# Altium project Universal_PLC.PrjPcb (part 1 of 2)
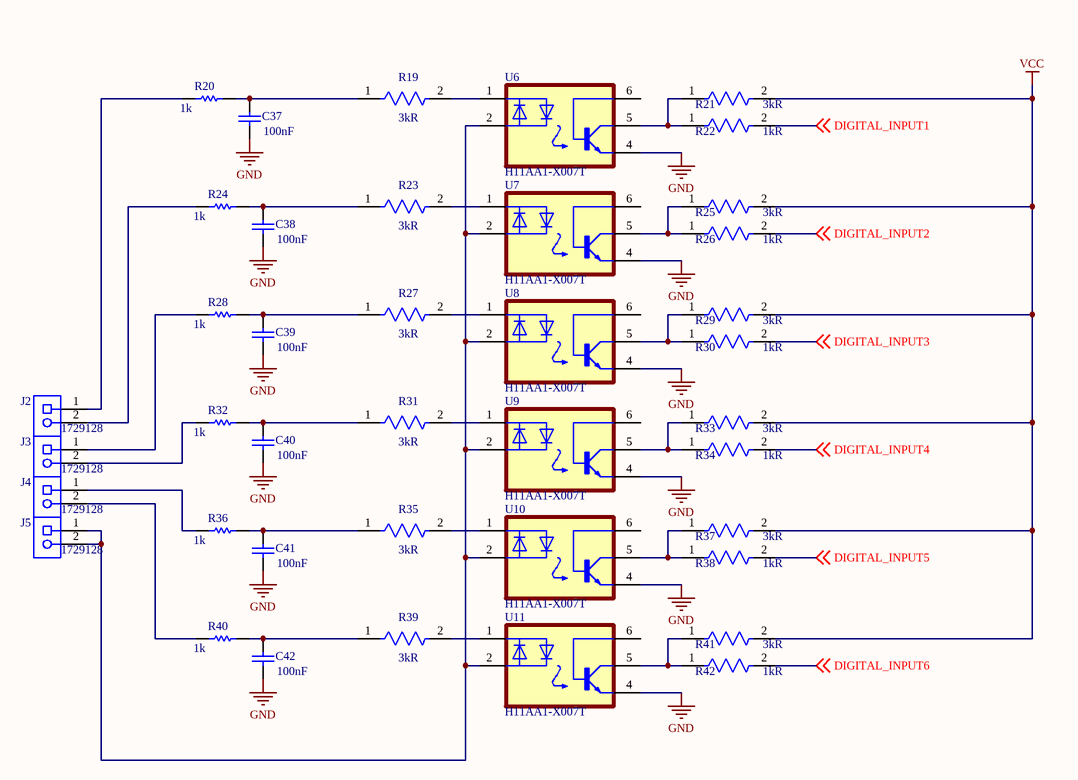
[diagram p0: Digital_Input.SchDoc]
8 sheets, 283 parts. Net scope: global (net labels, ports and power ports of the same name join across sheets).
Board file: Universal_PCB.PcbDoc
Sheets:
  Digital_Input.SchDoc
  Digital_Input2.SchDoc
  Digital_Input3.SchDoc
  DIGITAL_OUTPUT.SchDoc
  DIGITAL_OUTPUT1.SchDoc
  ANALOG_IOUTPUT.SchDoc
  ANALOG_VOUTPUT.SchDoc
  Temp_sensors Input.SchDoc

## Sheet Digital_Input.SchDoc
size A4; SheetNumber: 2; SheetTotal: 16

### Parts
C37  value 100nF  [CAPC1608X87X35NL15T15]  (hidden comment: C0603T104K3RACTU)
C38  value 100nF  [CAPC1608X87X35NL15T15]  (hidden comment: C0603T104K3RACTU)
C39  value 100nF  [CAPC1608X87X35NL15T15]  (hidden comment: C0603T104K3RACTU)
C40  value 100nF  [CAPC1608X87X35NL15T15]  (hidden comment: C0603T104K3RACTU)
C41  value 100nF  [CAPC1608X87X35NL15T15]  (hidden comment: C0603T104K3RACTU)
C42  value 100nF  [CAPC1608X87X35NL15T15]  (hidden comment: C0603T104K3RACTU)
J2  1729128  [PHOE-1729128-2_V]
J3  1729128  [PHOE-1729128-2_V]
J4  1729128  [PHOE-1729128-2_V]
J5  1729128  [PHOE-1729128-2_V]
R19  Resistance: 3kR  [FP-CRCW0603-e3-IPC_A]  (hidden comment: CRCW06033K00FKEA)
R20  value 1k  [RESC1608X55X25LL10T15]  (hidden comment: RT0603DRE071KL)
R21  Resistance: 3kR  [FP-CRCW0603-e3-IPC_A]  (hidden comment: CRCW06033K00FKEA)
R22  Resistance: 1kR  [FP-RC0603-0_55-IPC_C]  (hidden comment: RC0603FR-071KL)
R23  Resistance: 3kR  [FP-CRCW0603-e3-IPC_A]  (hidden comment: CRCW06033K00FKEA)
R24  value 1k  [RESC1608X55X25LL10T15]  (hidden comment: RT0603DRE071KL)
R25  Resistance: 3kR  [FP-CRCW0603-e3-IPC_A]  (hidden comment: CRCW06033K00FKEA)
R26  Resistance: 1kR  [FP-RC0603-0_55-IPC_C]  (hidden comment: RC0603FR-071KL)
R27  Resistance: 3kR  [FP-CRCW0603-e3-IPC_A]  (hidden comment: CRCW06033K00FKEA)
R28  value 1k  [RESC1608X55X25LL10T15]  (hidden comment: RT0603DRE071KL)
R29  Resistance: 3kR  [FP-CRCW0603-e3-IPC_A]  (hidden comment: CRCW06033K00FKEA)
R30  Resistance: 1kR  [FP-RC0603-0_55-IPC_C]  (hidden comment: RC0603FR-071KL)
R31  Resistance: 3kR  [FP-CRCW0603-e3-IPC_A]  (hidden comment: CRCW06033K00FKEA)
R32  value 1k  [RESC1608X55X25LL10T15]  (hidden comment: RT0603DRE071KL)
R33  Resistance: 3kR  [FP-CRCW0603-e3-IPC_A]  (hidden comment: CRCW06033K00FKEA)
R34  Resistance: 1kR  [FP-RC0603-0_55-IPC_C]  (hidden comment: RC0603FR-071KL)
R35  Resistance: 3kR  [FP-CRCW0603-e3-IPC_A]  (hidden comment: CRCW06033K00FKEA)
R36  value 1k  [RESC1608X55X25LL10T15]  (hidden comment: RT0603DRE071KL)
R37  Resistance: 3kR  [FP-CRCW0603-e3-IPC_A]  (hidden comment: CRCW06033K00FKEA)
R38  Resistance: 1kR  [FP-RC0603-0_55-IPC_C]  (hidden comment: RC0603FR-071KL)
R39  Resistance: 3kR  [FP-CRCW0603-e3-IPC_A]  (hidden comment: CRCW06033K00FKEA)
R40  value 1k  [RESC1608X55X25LL10T15]  (hidden comment: RT0603DRE071KL)
R41  Resistance: 3kR  [FP-CRCW0603-e3-IPC_A]  (hidden comment: CRCW06033K00FKEA)
R42  Resistance: 1kR  [FP-RC0603-0_55-IPC_C]  (hidden comment: RC0603FR-071KL)
U6  H11AA1-X007T  [SOIC254P1030X460-6N]
U7  H11AA1-X007T  [SOIC254P1030X460-6N]
U8  H11AA1-X007T  [SOIC254P1030X460-6N]
U9  H11AA1-X007T  [SOIC254P1030X460-6N]
U10  H11AA1-X007T  [SOIC254P1030X460-6N]
U11  H11AA1-X007T  [SOIC254P1030X460-6N]

### Nets
GND: C37.1 C38.1 C39.1 C40.1 C41.1 C42.1 U6.4(E) U7.4(E) U8.4(E) U9.4(E) U10.4(E) U11.4(E)
VCC: R21.2 R25.2 R29.2 R33.2 R37.2 R41.2
DIGITAL_INPUT1: R22.2 ; off-sheet DIGITAL_INPUT1
DIGITAL_INPUT2: R26.2 ; off-sheet DIGITAL_INPUT2
DIGITAL_INPUT3: R30.2 ; off-sheet DIGITAL_INPUT3
DIGITAL_INPUT4: R34.2 ; off-sheet DIGITAL_INPUT4
DIGITAL_INPUT5: R38.2 ; off-sheet DIGITAL_INPUT5
DIGITAL_INPUT6: R42.2 ; off-sheet DIGITAL_INPUT6
NetC37_2: C37.2 R19.1 R20.2
NetC38_2: C38.2 R23.1 R24.2
NetC39_2: C39.2 R27.1 R28.2
NetC40_2: C40.2 R31.1 R32.2
NetC41_2: C41.2 R35.1 R36.2
NetC42_2: C42.2 R39.1 R40.2
NetJ2_1: J2.1 R20.1
NetJ2_2: J2.2 R24.1
NetJ3_1: J3.1 R28.1
NetJ3_2: J3.2 R32.1
NetJ4_1: J4.1 R36.1
NetJ4_2: J4.2 R40.1
NetJ5_1: J5.1 J5.2 U6.2(C/A) U7.2(C/A) U8.2(C/A) U9.2(C/A) U10.2(C/A) U11.2(C/A)
NetR19_2: R19.2 U6.1(A/C)
NetR21_1: R21.1 R22.1 U6.5(C)
NetR23_2: R23.2 U7.1(A/C)
NetR25_1: R25.1 R26.1 U7.5(C)
NetR27_2: R27.2 U8.1(A/C)
NetR29_1: R29.1 R30.1 U8.5(C)
NetR31_2: R31.2 U9.1(A/C)
NetR33_1: R33.1 R34.1 U9.5(C)
NetR35_2: R35.2 U10.1(A/C)
NetR37_1: R37.1 R38.1 U10.5(C)
NetR39_2: R39.2 U11.1(A/C)
NetR41_1: R41.1 R42.1 U11.5(C)

Not connected (* = marked no-connect by the designer): U6 6(B); U7 6(B); U8 6(B); U9 6(B); U10 6(B); U11 6(B)

### Library data of the parts
C37-C42 = CMP-2006-03843-1: Manufacturer: Kemet; Part Number: C0603T104K3RACTU
J2-J5 = CMP-2000-05815-1: PCB Terminal Block, 13.5 A, 400 V, 2-Pin THD, RoHS, Bulk; Manufacturer: Phoenix Contact; Package Version: 03/2015; No. of Rows: 1; Pitch: 5.08mm; No. of Positions: 2; Voltage Rating: 400V; Current Rating: 13500mA; Manufacturer URL: http://www.phoenixcontact.com/; Datasheet URL: https://datasheet.ciiva.com/16046/1729128-16046181.pdf; RoHS: TRUE; Package URL: https://www.phoenixcontact.com/online/portal/pi/pxc/product_detail_page/!ut/p/b1/3VdJjqNKFDxLH8AFycySyWY2ozFsEPOMMQaDOX1XedGL_1Vdm5YXJleknhSKeBkvI6EA8ncAo3AYoDhBQGco6KN7VURTdemj9us_IEKEZo_YHiPAEWEFmDGOHMORkqKYCORBZxgL7ZoaZYcbFFUZ3fqxSY6GOuxydWUuHqz1ynmMFygu583Bob0Ewr6Sd_l-5m-kAueHiB0jpRwZwe58wwtkpxtMYd_LmGcDRU02dRNEyWt6Y2ti5pSyJ_reIkzIulrqApdnbT11V5jnCKbYNCvhEM1MCpPByat_X379-iThf08CI5GfOPqfBeS3BRoBOdD55AKVv0iLwCMq-2BrzXWSGRH7pUGD9uwXQjiph3xL0DKQwdGa0JImiIOmBNOestqgwTHSSs2oOep-78apyXQBvNi8ZLaFjvjWvcaUEBu0MC6Wbe-d6mB0FAebo2lUWinqYaZs5DAYzV0RP9yitUjnGJ0iI9xhZkT42OCQNUJJhkgWINNQLP2JFP6OpMg3JCVg70jqHT0lvKOnhHf0lPuOnnLf0VPuWx6_dxwUIvwk5WMkT0kLL1mh61l2yZVSzG3pYV_bqo-mj6uMKwKwdnnW8Jh5RTOJzMOA5c-eJDaZQw4mTMPH02PvS_ZAqNVjVTo2WyYLkwH_KU1mmmG5kjRhDqPXLwwVHvVOjCM60-fpXvTDfMGW1PVFVS1r4e4yVDk4ZdNbkUHvqPqQSeian4UD39fNKmachqdJ1NJbyk8rXT9mXTvPk3oE5meulKGgiruPJek-4I9hTT6G8ZLOyRSm2RRVbThERQad5OS28hdt4YW4vG0stgYYzsWsK4_7y6DZMjJSCqri1kyiZR5vD7pwIrNR7QwPHTcLTI5qT7eRlpHrdGiupYlqQDJ7zy_CND8fWWBoLRXxk1RVcXiBQwbTD4Xi7KL-FuO94t9xaqweXzH; PartNumber: 1729128; Package Description: 2-Pin Through Hole Device, Body 8.1 x 10.16 mm, Pitch 5.08 mm; Datasheet Version: 12/2013; Mounting Technology: ThroughHole; Orientation: Horizontal; Package Reference: 1729128-2; Packing: Bulk
R19 R21 R23 R25 R27 R29 R31 R33 R35 R37 R39 R41 = CMP-2000-03293-2: RES Thick Film, 3kΩ, 1%, 0.1W, 100ppm/°C, 0603; Voltage Rating: 75V; Power Rating: 100mW; Features: Automotive AEC-Q200; Radiation Hardening: No; Contact Plating: Tin; Termination: SMD/SMT; Lead Free: Lead Free; Case Code (Imperial): 0603; Case Code (Metric): 1608; Case/Package: 0603; Depth: 0.85mm; Mount: Surface Mount; Voltage Rating (DC): 75V; Tolerance: 1%; Package Quantity: 10; Temperature Coefficient: 100ppm/°C; Height: 0.45mm; Max Power Dissipation: 100mW; Composition: Thick Film; Max Operating Temperature: 155°C; Military Standard: Not; Weight: 7.1E-05oz; Length: 1.55mm; Packaging: Tape and Reel; Number of Terminations: 2; Width: 0.85mm; Min Operating Temperature: -55°C
R20 R24 R28 R32 R36 R40 = CMP-2000-04615-1: Manufacturer: Yageo; Part Number: RT0603DRE071KL
R22 R26 R30 R34 R38 R42 = CMP-1659-00009-5: RES 1K OHM 1% 1/10W 0603; Voltage Rating: 50V; Power Rating: 100mW; Temperature Coefficient: 100ppm/°C; Military Standard: Not; REACH SVHC: No SVHC; Size Code: 0603; Features: Moisture Resistant; Number of Terminations: 2; Technology: THICK FILM; Series: RC; Case Code (Metric): 1608; Resistance Tolerance: 1%; Resistor Type: Thick Film; Termination: SMD/SMT; Contact Plating: Tin; Radiation Hardening: No; Min Operating Temperature: -55°C; Max Operating Temperature: 155°C; Packaging: Tape and Reel; Max Power Dissipation: 100mW; RoHS Compliant: Yes; Height: 0.45mm; Lead Free: Lead Free; Case/Package: 0603; Length: 1.6mm; Tolerance: 1%; Case Code (Imperial): 0603; Construction: Rectangular; Depth: 0.8mm
U6-U11 = H11AA1-X007T: H11AA1 Series Single Channel 30V 5300 Vrms SMT Phototransistor Optocoupler DIP-6; MF: Vishay Semiconductor; SnapEDA_Link: https://www.snapeda.com/parts/H11AA1-X007T/Vishay/view-part/?ref=snap; Package: SMD-6 Vishay; Value: *; MP: H11AA1-X007T; Check_prices: https://www.snapeda.com/parts/H11AA1-X007T/Vishay/view-part/?ref=eda

## Sheet Digital_Input2.SchDoc
size A4; SheetNumber: 3; SheetTotal: 16
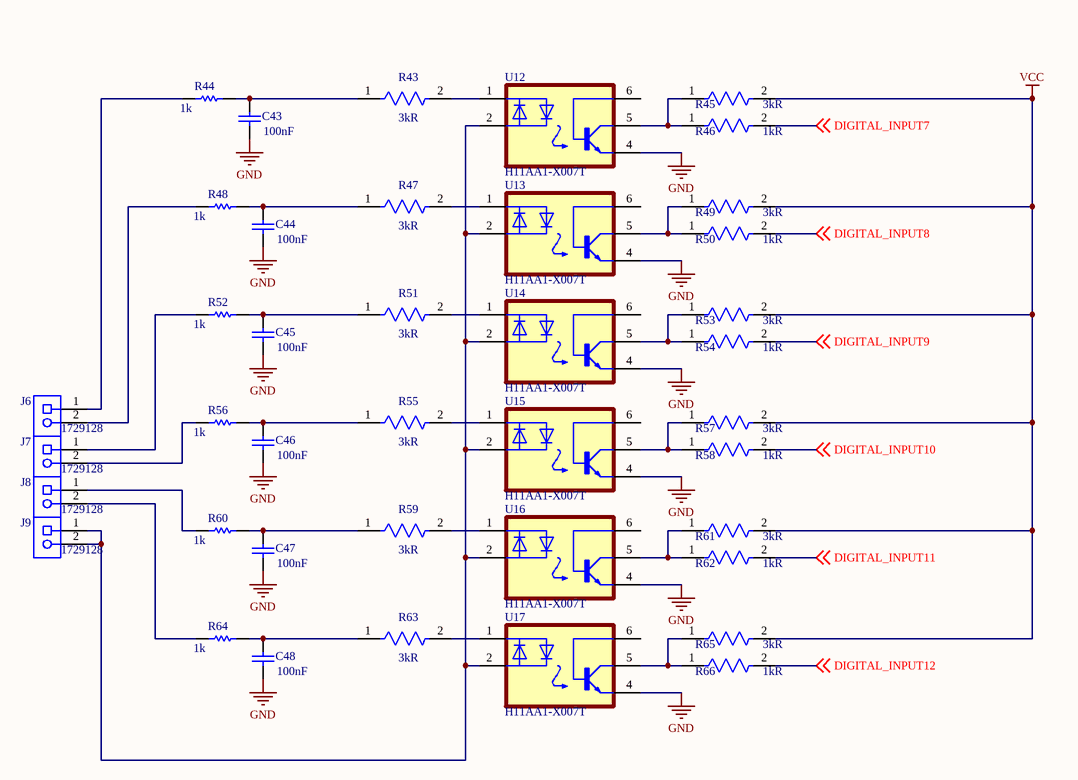
[diagram p1: Digital_Input2.SchDoc]

### Parts
C43  value 100nF  [CAPC1608X87X35NL15T15]  (hidden comment: C0603T104K3RACTU)
C44  value 100nF  [CAPC1608X87X35NL15T15]  (hidden comment: C0603T104K3RACTU)
C45  value 100nF  [CAPC1608X87X35NL15T15]  (hidden comment: C0603T104K3RACTU)
C46  value 100nF  [CAPC1608X87X35NL15T15]  (hidden comment: C0603T104K3RACTU)
C47  value 100nF  [CAPC1608X87X35NL15T15]  (hidden comment: C0603T104K3RACTU)
C48  value 100nF  [CAPC1608X87X35NL15T15]  (hidden comment: C0603T104K3RACTU)
J6  1729128  [PHOE-1729128-2_V]
J7  1729128  [PHOE-1729128-2_V]
J8  1729128  [PHOE-1729128-2_V]
J9  1729128  [PHOE-1729128-2_V]
R43  Resistance: 3kR  [FP-CRCW0603-e3-IPC_A]  (hidden comment: CRCW06033K00FKEA)
R44  value 1k  [RESC1608X55X25LL10T15]  (hidden comment: RT0603DRE071KL)
R45  Resistance: 3kR  [FP-CRCW0603-e3-IPC_A]  (hidden comment: CRCW06033K00FKEA)
R46  Resistance: 1kR  [FP-RC0603-0_55-IPC_C]  (hidden comment: RC0603FR-071KL)
R47  Resistance: 3kR  [FP-CRCW0603-e3-IPC_A]  (hidden comment: CRCW06033K00FKEA)
R48  value 1k  [RESC1608X55X25LL10T15]  (hidden comment: RT0603DRE071KL)
R49  Resistance: 3kR  [FP-CRCW0603-e3-IPC_A]  (hidden comment: CRCW06033K00FKEA)
R50  Resistance: 1kR  [FP-RC0603-0_55-IPC_C]  (hidden comment: RC0603FR-071KL)
R51  Resistance: 3kR  [FP-CRCW0603-e3-IPC_A]  (hidden comment: CRCW06033K00FKEA)
R52  value 1k  [RESC1608X55X25LL10T15]  (hidden comment: RT0603DRE071KL)
R53  Resistance: 3kR  [FP-CRCW0603-e3-IPC_A]  (hidden comment: CRCW06033K00FKEA)
R54  Resistance: 1kR  [FP-RC0603-0_55-IPC_C]  (hidden comment: RC0603FR-071KL)
R55  Resistance: 3kR  [FP-CRCW0603-e3-IPC_A]  (hidden comment: CRCW06033K00FKEA)
R56  value 1k  [RESC1608X55X25LL10T15]  (hidden comment: RT0603DRE071KL)
R57  Resistance: 3kR  [FP-CRCW0603-e3-IPC_A]  (hidden comment: CRCW06033K00FKEA)
R58  Resistance: 1kR  [FP-RC0603-0_55-IPC_C]  (hidden comment: RC0603FR-071KL)
R59  Resistance: 3kR  [FP-CRCW0603-e3-IPC_A]  (hidden comment: CRCW06033K00FKEA)
R60  value 1k  [RESC1608X55X25LL10T15]  (hidden comment: RT0603DRE071KL)
R61  Resistance: 3kR  [FP-CRCW0603-e3-IPC_A]  (hidden comment: CRCW06033K00FKEA)
R62  Resistance: 1kR  [FP-RC0603-0_55-IPC_C]  (hidden comment: RC0603FR-071KL)
R63  Resistance: 3kR  [FP-CRCW0603-e3-IPC_A]  (hidden comment: CRCW06033K00FKEA)
R64  value 1k  [RESC1608X55X25LL10T15]  (hidden comment: RT0603DRE071KL)
R65  Resistance: 3kR  [FP-CRCW0603-e3-IPC_A]  (hidden comment: CRCW06033K00FKEA)
R66  Resistance: 1kR  [FP-RC0603-0_55-IPC_C]  (hidden comment: RC0603FR-071KL)
U12  H11AA1-X007T  [SOIC254P1030X460-6N]
U13  H11AA1-X007T  [SOIC254P1030X460-6N]
U14  H11AA1-X007T  [SOIC254P1030X460-6N]
U15  H11AA1-X007T  [SOIC254P1030X460-6N]
U16  H11AA1-X007T  [SOIC254P1030X460-6N]
U17  H11AA1-X007T  [SOIC254P1030X460-6N]

### Nets
GND: C43.1 C44.1 C45.1 C46.1 C47.1 C48.1 U12.4(E) U13.4(E) U14.4(E) U15.4(E) U16.4(E) U17.4(E)
VCC: R45.2 R49.2 R53.2 R57.2 R61.2 R65.2
DIGITAL_INPUT7: R46.2 ; off-sheet DIGITAL_INPUT7
DIGITAL_INPUT8: R50.2 ; off-sheet DIGITAL_INPUT8
DIGITAL_INPUT9: R54.2 ; off-sheet DIGITAL_INPUT9
DIGITAL_INPUT10: R58.2 ; off-sheet DIGITAL_INPUT10
DIGITAL_INPUT11: R62.2 ; off-sheet DIGITAL_INPUT11
DIGITAL_INPUT12: R66.2 ; off-sheet DIGITAL_INPUT12
NetC43_2: C43.2 R43.1 R44.2
NetC44_2: C44.2 R47.1 R48.2
NetC45_2: C45.2 R51.1 R52.2
NetC46_2: C46.2 R55.1 R56.2
NetC47_2: C47.2 R59.1 R60.2
NetC48_2: C48.2 R63.1 R64.2
NetJ6_1: J6.1 R44.1
NetJ6_2: J6.2 R48.1
NetJ7_1: J7.1 R52.1
NetJ7_2: J7.2 R56.1
NetJ8_1: J8.1 R60.1
NetJ8_2: J8.2 R64.1
NetJ9_1: J9.1 J9.2 U12.2(C/A) U13.2(C/A) U14.2(C/A) U15.2(C/A) U16.2(C/A) U17.2(C/A)
NetR43_2: R43.2 U12.1(A/C)
NetR45_1: R45.1 R46.1 U12.5(C)
NetR47_2: R47.2 U13.1(A/C)
NetR49_1: R49.1 R50.1 U13.5(C)
NetR51_2: R51.2 U14.1(A/C)
NetR53_1: R53.1 R54.1 U14.5(C)
NetR55_2: R55.2 U15.1(A/C)
NetR57_1: R57.1 R58.1 U15.5(C)
NetR59_2: R59.2 U16.1(A/C)
NetR61_1: R61.1 R62.1 U16.5(C)
NetR63_2: R63.2 U17.1(A/C)
NetR65_1: R65.1 R66.1 U17.5(C)

Not connected (* = marked no-connect by the designer): U12 6(B); U13 6(B); U14 6(B); U15 6(B); U16 6(B); U17 6(B)

### Library data of the parts
C43-C48 = CMP-2006-03843-1: Manufacturer: Kemet; Part Number: C0603T104K3RACTU
J6-J9 = CMP-2000-05815-1: as J2 on sheet Digital_Input; Manufacturer URL: http://www.phoenixcontact.com/; Datasheet URL: https://datasheet.ciiva.com/16046/1729128-16046181.pdf; RoHS: TRUE; Package URL: https://www.phoenixcontact.com/online/portal/pi/pxc/product_detail_page/!ut/p/b1/3VdJjqNKFDxLH8AFycySyWY2ozFsEPOMMQaDOX1XedGL_1Vdm5YXJleknhSKeBkvI6EA8ncAo3AYoDhBQGco6KN7VURTdemj9us_IEKEZo_YHiPAEWEFmDGOHMORkqKYCORBZxgL7ZoaZYcbFFUZ3fqxSY6GOuxydWUuHqz1ynmMFygu583Bob0Ewr6Sd_l-5m-kAueHiB0jpRwZwe58wwtkpxtMYd_LmGcDRU02dRNEyWt6Y2ti5pSyJ_reIkzIulrqApdnbT11V5jnCKbYNCvhEM1MCpPByat_X379-iThf08CI5GfOPqfBeS3BRoBOdD55AKVv0iLwCMq-2BrzXWSGRH7pUGD9uwXQjiph3xL0DKQwdGa0JImiIOmBNOestqgwTHSSs2oOep-78apyXQBvNi8ZLaFjvjWvcaUEBu0MC6Wbe-d6mB0FAebo2lUWinqYaZs5DAYzV0RP9yitUjnGJ0iI9xhZkT42OCQNUJJhkgWINNQLP2JFP6OpMg3JCVg70jqHT0lvKOnhHf0lPuOnnLf0VPuWx6_dxwUIvwk5WMkT0kLL1mh61l2yZVSzG3pYV_bqo-mj6uMKwKwdnnW8Jh5RTOJzMOA5c-eJDaZQw4mTMPH02PvS_ZAqNVjVTo2WyYLkwH_KU1mmmG5kjRhDqPXLwwVHvVOjCM60-fpXvTDfMGW1PVFVS1r4e4yVDk4ZdNbkUHvqPqQSeian4UD39fNKmachqdJ1NJbyk8rXT9mXTvPk3oE5meulKGgiruPJek-4I9hTT6G8ZLOyRSm2RRVbThERQad5OS28hdt4YW4vG0stgYYzsWsK4_7y6DZMjJSCqri1kyiZR5vD7pwIrNR7QwPHTcLTI5qT7eRlpHrdGiupYlqQDJ7zy_CND8fWWBoLRXxk1RVcXiBQwbTD4Xi7KL-FuO94t9xaqweXzH; PartNumber: 1729128; Package Description: 2-Pin Through Hole Device, Body 8.1 x 10.16 mm, Pitch 5.08 mm; Datasheet Version: 12/2013; Mounting Technology: ThroughHole; Orientation: Horizontal; Package Reference: 1729128-2; Packing: Bulk
R43 R45 R47 R49 R51 R53 R55 R57 R59 R61 R63 R65 = CMP-2000-03293-2: as R19 on sheet Digital_Input; Features: Automotive AEC-Q200; Radiation Hardening: No; Contact Plating: Tin; Termination: SMD/SMT; Lead Free: Lead Free; Case Code (Imperial): 0603; Case Code (Metric): 1608; Case/Package: 0603; Depth: 0.85mm; Mount: Surface Mount; Voltage Rating (DC): 75V; Tolerance: 1%; Package Quantity: 10; Temperature Coefficient: 100ppm/°C; Height: 0.45mm; Max Power Dissipation: 100mW; Composition: Thick Film; Max Operating Temperature: 155°C; Military Standard: Not; Weight: 7.1E-05oz; Length: 1.55mm; Packaging: Tape and Reel; Number of Terminations: 2; Width: 0.85mm; Min Operating Temperature: -55°C
R44 R48 R52 R56 R60 R64 = CMP-2000-04615-1: Manufacturer: Yageo; Part Number: RT0603DRE071KL
R46 R50 R54 R58 R62 R66 = CMP-1659-00009-5: as R22 on sheet Digital_Input; Military Standard: Not; REACH SVHC: No SVHC; Size Code: 0603; Features: Moisture Resistant; Number of Terminations: 2; Technology: THICK FILM; Series: RC; Case Code (Metric): 1608; Resistance Tolerance: 1%; Resistor Type: Thick Film; Termination: SMD/SMT; Contact Plating: Tin; Radiation Hardening: No; Min Operating Temperature: -55°C; Max Operating Temperature: 155°C; Packaging: Tape and Reel; Max Power Dissipation: 100mW; RoHS Compliant: Yes; Height: 0.45mm; Lead Free: Lead Free; Case/Package: 0603; Length: 1.6mm; Tolerance: 1%; Case Code (Imperial): 0603; Construction: Rectangular; Depth: 0.8mm
U12-U17 = H11AA1-X007T: as U6 on sheet Digital_Input; SnapEDA_Link: https://www.snapeda.com/parts/H11AA1-X007T/Vishay/view-part/?ref=snap; Package: SMD-6 Vishay; Value: *; MP: H11AA1-X007T; Check_prices: https://www.snapeda.com/parts/H11AA1-X007T/Vishay/view-part/?ref=eda

## Sheet Digital_Input3.SchDoc
size A4; SheetNumber: 4; SheetTotal: 16
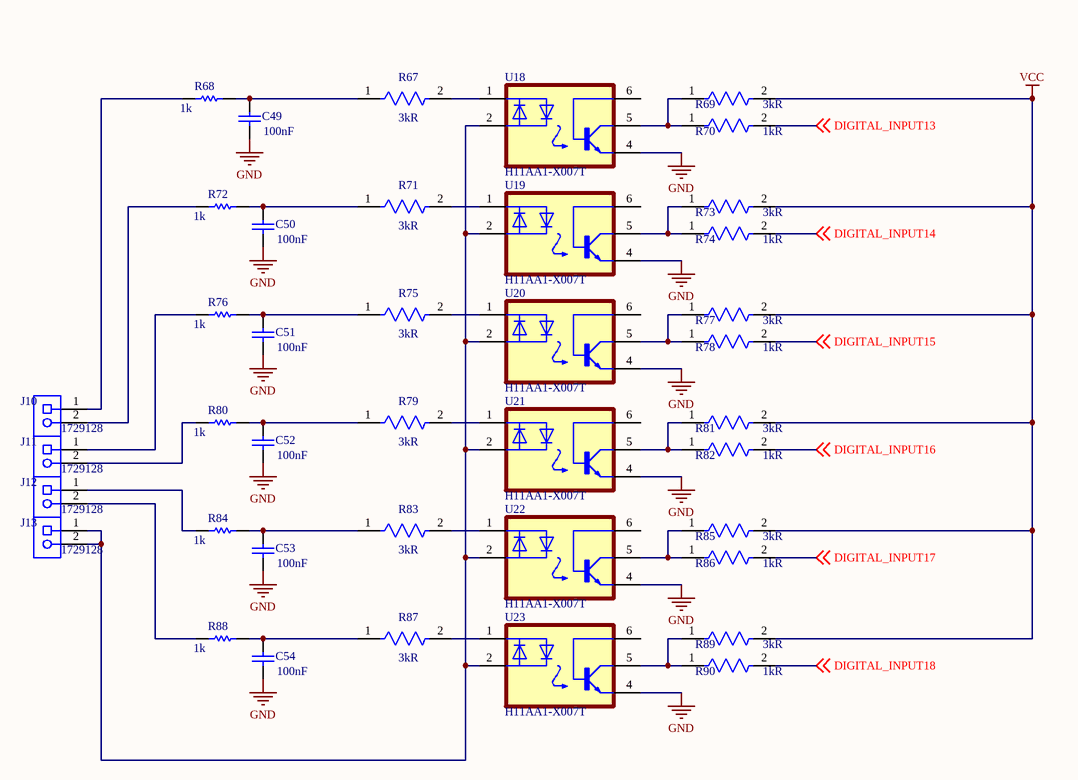
[diagram p2: Digital_Input3.SchDoc]

### Parts
C49  value 100nF  [CAPC1608X87X35NL15T15]  (hidden comment: C0603T104K3RACTU)
C50  value 100nF  [CAPC1608X87X35NL15T15]  (hidden comment: C0603T104K3RACTU)
C51  value 100nF  [CAPC1608X87X35NL15T15]  (hidden comment: C0603T104K3RACTU)
C52  value 100nF  [CAPC1608X87X35NL15T15]  (hidden comment: C0603T104K3RACTU)
C53  value 100nF  [CAPC1608X87X35NL15T15]  (hidden comment: C0603T104K3RACTU)
C54  value 100nF  [CAPC1608X87X35NL15T15]  (hidden comment: C0603T104K3RACTU)
J10  1729128  [PHOE-1729128-2_V]
J11  1729128  [PHOE-1729128-2_V]
J12  1729128  [PHOE-1729128-2_V]
J13  1729128  [PHOE-1729128-2_V]
R67  Resistance: 3kR  [FP-CRCW0603-e3-IPC_A]  (hidden comment: CRCW06033K00FKEA)
R68  value 1k  [RESC1608X55X25LL10T15]  (hidden comment: RT0603DRE071KL)
R69  Resistance: 3kR  [FP-CRCW0603-e3-IPC_A]  (hidden comment: CRCW06033K00FKEA)
R70  Resistance: 1kR  [FP-RC0603-0_55-IPC_C]  (hidden comment: RC0603FR-071KL)
R71  Resistance: 3kR  [FP-CRCW0603-e3-IPC_A]  (hidden comment: CRCW06033K00FKEA)
R72  value 1k  [RESC1608X55X25LL10T15]  (hidden comment: RT0603DRE071KL)
R73  Resistance: 3kR  [FP-CRCW0603-e3-IPC_A]  (hidden comment: CRCW06033K00FKEA)
R74  Resistance: 1kR  [FP-RC0603-0_55-IPC_C]  (hidden comment: RC0603FR-071KL)
R75  Resistance: 3kR  [FP-CRCW0603-e3-IPC_A]  (hidden comment: CRCW06033K00FKEA)
R76  value 1k  [RESC1608X55X25LL10T15]  (hidden comment: RT0603DRE071KL)
R77  Resistance: 3kR  [FP-CRCW0603-e3-IPC_A]  (hidden comment: CRCW06033K00FKEA)
R78  Resistance: 1kR  [FP-RC0603-0_55-IPC_C]  (hidden comment: RC0603FR-071KL)
R79  Resistance: 3kR  [FP-CRCW0603-e3-IPC_A]  (hidden comment: CRCW06033K00FKEA)
R80  value 1k  [RESC1608X55X25LL10T15]  (hidden comment: RT0603DRE071KL)
R81  Resistance: 3kR  [FP-CRCW0603-e3-IPC_A]  (hidden comment: CRCW06033K00FKEA)
R82  Resistance: 1kR  [FP-RC0603-0_55-IPC_C]  (hidden comment: RC0603FR-071KL)
R83  Resistance: 3kR  [FP-CRCW0603-e3-IPC_A]  (hidden comment: CRCW06033K00FKEA)
R84  value 1k  [RESC1608X55X25LL10T15]  (hidden comment: RT0603DRE071KL)
R85  Resistance: 3kR  [FP-CRCW0603-e3-IPC_A]  (hidden comment: CRCW06033K00FKEA)
R86  Resistance: 1kR  [FP-RC0603-0_55-IPC_C]  (hidden comment: RC0603FR-071KL)
R87  Resistance: 3kR  [FP-CRCW0603-e3-IPC_A]  (hidden comment: CRCW06033K00FKEA)
R88  value 1k  [RESC1608X55X25LL10T15]  (hidden comment: RT0603DRE071KL)
R89  Resistance: 3kR  [FP-CRCW0603-e3-IPC_A]  (hidden comment: CRCW06033K00FKEA)
R90  Resistance: 1kR  [FP-RC0603-0_55-IPC_C]  (hidden comment: RC0603FR-071KL)
U18  H11AA1-X007T  [SOIC254P1030X460-6N]
U19  H11AA1-X007T  [SOIC254P1030X460-6N]
U20  H11AA1-X007T  [SOIC254P1030X460-6N]
U21  H11AA1-X007T  [SOIC254P1030X460-6N]
U22  H11AA1-X007T  [SOIC254P1030X460-6N]
U23  H11AA1-X007T  [SOIC254P1030X460-6N]

### Nets
GND: C49.1 C50.1 C51.1 C52.1 C53.1 C54.1 U18.4(E) U19.4(E) U20.4(E) U21.4(E) U22.4(E) U23.4(E)
VCC: R69.2 R73.2 R77.2 R81.2 R85.2 R89.2
DIGITAL_INPUT13: R70.2 ; off-sheet DIGITAL_INPUT13
DIGITAL_INPUT14: R74.2 ; off-sheet DIGITAL_INPUT14
DIGITAL_INPUT15: R78.2 ; off-sheet DIGITAL_INPUT15
DIGITAL_INPUT16: R82.2 ; off-sheet DIGITAL_INPUT16
DIGITAL_INPUT17: R86.2 ; off-sheet DIGITAL_INPUT17
DIGITAL_INPUT18: R90.2 ; off-sheet DIGITAL_INPUT18
NetC49_2: C49.2 R67.1 R68.2
NetC50_2: C50.2 R71.1 R72.2
NetC51_2: C51.2 R75.1 R76.2
NetC52_2: C52.2 R79.1 R80.2
NetC53_2: C53.2 R83.1 R84.2
NetC54_2: C54.2 R87.1 R88.2
NetJ10_1: J10.1 R68.1
NetJ10_2: J10.2 R72.1
NetJ11_1: J11.1 R76.1
NetJ11_2: J11.2 R80.1
NetJ12_1: J12.1 R84.1
NetJ12_2: J12.2 R88.1
NetJ13_1: J13.1 J13.2 U18.2(C/A) U19.2(C/A) U20.2(C/A) U21.2(C/A) U22.2(C/A) U23.2(C/A)
NetR67_2: R67.2 U18.1(A/C)
NetR69_1: R69.1 R70.1 U18.5(C)
NetR71_2: R71.2 U19.1(A/C)
NetR73_1: R73.1 R74.1 U19.5(C)
NetR75_2: R75.2 U20.1(A/C)
NetR77_1: R77.1 R78.1 U20.5(C)
NetR79_2: R79.2 U21.1(A/C)
NetR81_1: R81.1 R82.1 U21.5(C)
NetR83_2: R83.2 U22.1(A/C)
NetR85_1: R85.1 R86.1 U22.5(C)
NetR87_2: R87.2 U23.1(A/C)
NetR89_1: R89.1 R90.1 U23.5(C)

Not connected (* = marked no-connect by the designer): U18 6(B); U19 6(B); U20 6(B); U21 6(B); U22 6(B); U23 6(B)

### Library data of the parts
C49-C54 = CMP-2006-03843-1: Manufacturer: Kemet; Part Number: C0603T104K3RACTU
J10-J13 = CMP-2000-05815-1: as J2 on sheet Digital_Input; Manufacturer URL: http://www.phoenixcontact.com/; Datasheet URL: https://datasheet.ciiva.com/16046/1729128-16046181.pdf; RoHS: TRUE; Package URL: https://www.phoenixcontact.com/online/portal/pi/pxc/product_detail_page/!ut/p/b1/3VdJjqNKFDxLH8AFycySyWY2ozFsEPOMMQaDOX1XedGL_1Vdm5YXJleknhSKeBkvI6EA8ncAo3AYoDhBQGco6KN7VURTdemj9us_IEKEZo_YHiPAEWEFmDGOHMORkqKYCORBZxgL7ZoaZYcbFFUZ3fqxSY6GOuxydWUuHqz1ynmMFygu583Bob0Ewr6Sd_l-5m-kAueHiB0jpRwZwe58wwtkpxtMYd_LmGcDRU02dRNEyWt6Y2ti5pSyJ_reIkzIulrqApdnbT11V5jnCKbYNCvhEM1MCpPByat_X379-iThf08CI5GfOPqfBeS3BRoBOdD55AKVv0iLwCMq-2BrzXWSGRH7pUGD9uwXQjiph3xL0DKQwdGa0JImiIOmBNOestqgwTHSSs2oOep-78apyXQBvNi8ZLaFjvjWvcaUEBu0MC6Wbe-d6mB0FAebo2lUWinqYaZs5DAYzV0RP9yitUjnGJ0iI9xhZkT42OCQNUJJhkgWINNQLP2JFP6OpMg3JCVg70jqHT0lvKOnhHf0lPuOnnLf0VPuWx6_dxwUIvwk5WMkT0kLL1mh61l2yZVSzG3pYV_bqo-mj6uMKwKwdnnW8Jh5RTOJzMOA5c-eJDaZQw4mTMPH02PvS_ZAqNVjVTo2WyYLkwH_KU1mmmG5kjRhDqPXLwwVHvVOjCM60-fpXvTDfMGW1PVFVS1r4e4yVDk4ZdNbkUHvqPqQSeian4UD39fNKmachqdJ1NJbyk8rXT9mXTvPk3oE5meulKGgiruPJek-4I9hTT6G8ZLOyRSm2RRVbThERQad5OS28hdt4YW4vG0stgYYzsWsK4_7y6DZMjJSCqri1kyiZR5vD7pwIrNR7QwPHTcLTI5qT7eRlpHrdGiupYlqQDJ7zy_CND8fWWBoLRXxk1RVcXiBQwbTD4Xi7KL-FuO94t9xaqweXzH; PartNumber: 1729128; Package Description: 2-Pin Through Hole Device, Body 8.1 x 10.16 mm, Pitch 5.08 mm; Datasheet Version: 12/2013; Mounting Technology: ThroughHole; Orientation: Horizontal; Package Reference: 1729128-2; Packing: Bulk
R67 R69 R71 R73 R75 R77 R79 R81 R83 R85 R87 R89 = CMP-2000-03293-2: as R19 on sheet Digital_Input; Features: Automotive AEC-Q200; Radiation Hardening: No; Contact Plating: Tin; Termination: SMD/SMT; Lead Free: Lead Free; Case Code (Imperial): 0603; Case Code (Metric): 1608; Case/Package: 0603; Depth: 0.85mm; Mount: Surface Mount; Voltage Rating (DC): 75V; Tolerance: 1%; Package Quantity: 10; Temperature Coefficient: 100ppm/°C; Height: 0.45mm; Max Power Dissipation: 100mW; Composition: Thick Film; Max Operating Temperature: 155°C; Military Standard: Not; Weight: 7.1E-05oz; Length: 1.55mm; Packaging: Tape and Reel; Number of Terminations: 2; Width: 0.85mm; Min Operating Temperature: -55°C
R68 R72 R76 R80 R84 R88 = CMP-2000-04615-1: Manufacturer: Yageo; Part Number: RT0603DRE071KL
R70 R74 R78 R82 R86 R90 = CMP-1659-00009-5: as R22 on sheet Digital_Input; Military Standard: Not; REACH SVHC: No SVHC; Size Code: 0603; Features: Moisture Resistant; Number of Terminations: 2; Technology: THICK FILM; Series: RC; Case Code (Metric): 1608; Resistance Tolerance: 1%; Resistor Type: Thick Film; Termination: SMD/SMT; Contact Plating: Tin; Radiation Hardening: No; Min Operating Temperature: -55°C; Max Operating Temperature: 155°C; Packaging: Tape and Reel; Max Power Dissipation: 100mW; RoHS Compliant: Yes; Height: 0.45mm; Lead Free: Lead Free; Case/Package: 0603; Length: 1.6mm; Tolerance: 1%; Case Code (Imperial): 0603; Construction: Rectangular; Depth: 0.8mm
U18-U23 = H11AA1-X007T: as U6 on sheet Digital_Input; SnapEDA_Link: https://www.snapeda.com/parts/H11AA1-X007T/Vishay/view-part/?ref=snap; Package: SMD-6 Vishay; Value: *; MP: H11AA1-X007T; Check_prices: https://www.snapeda.com/parts/H11AA1-X007T/Vishay/view-part/?ref=eda

## Sheet DIGITAL_OUTPUT.SchDoc
size A4; SheetNumber: 5; SheetTotal: 16
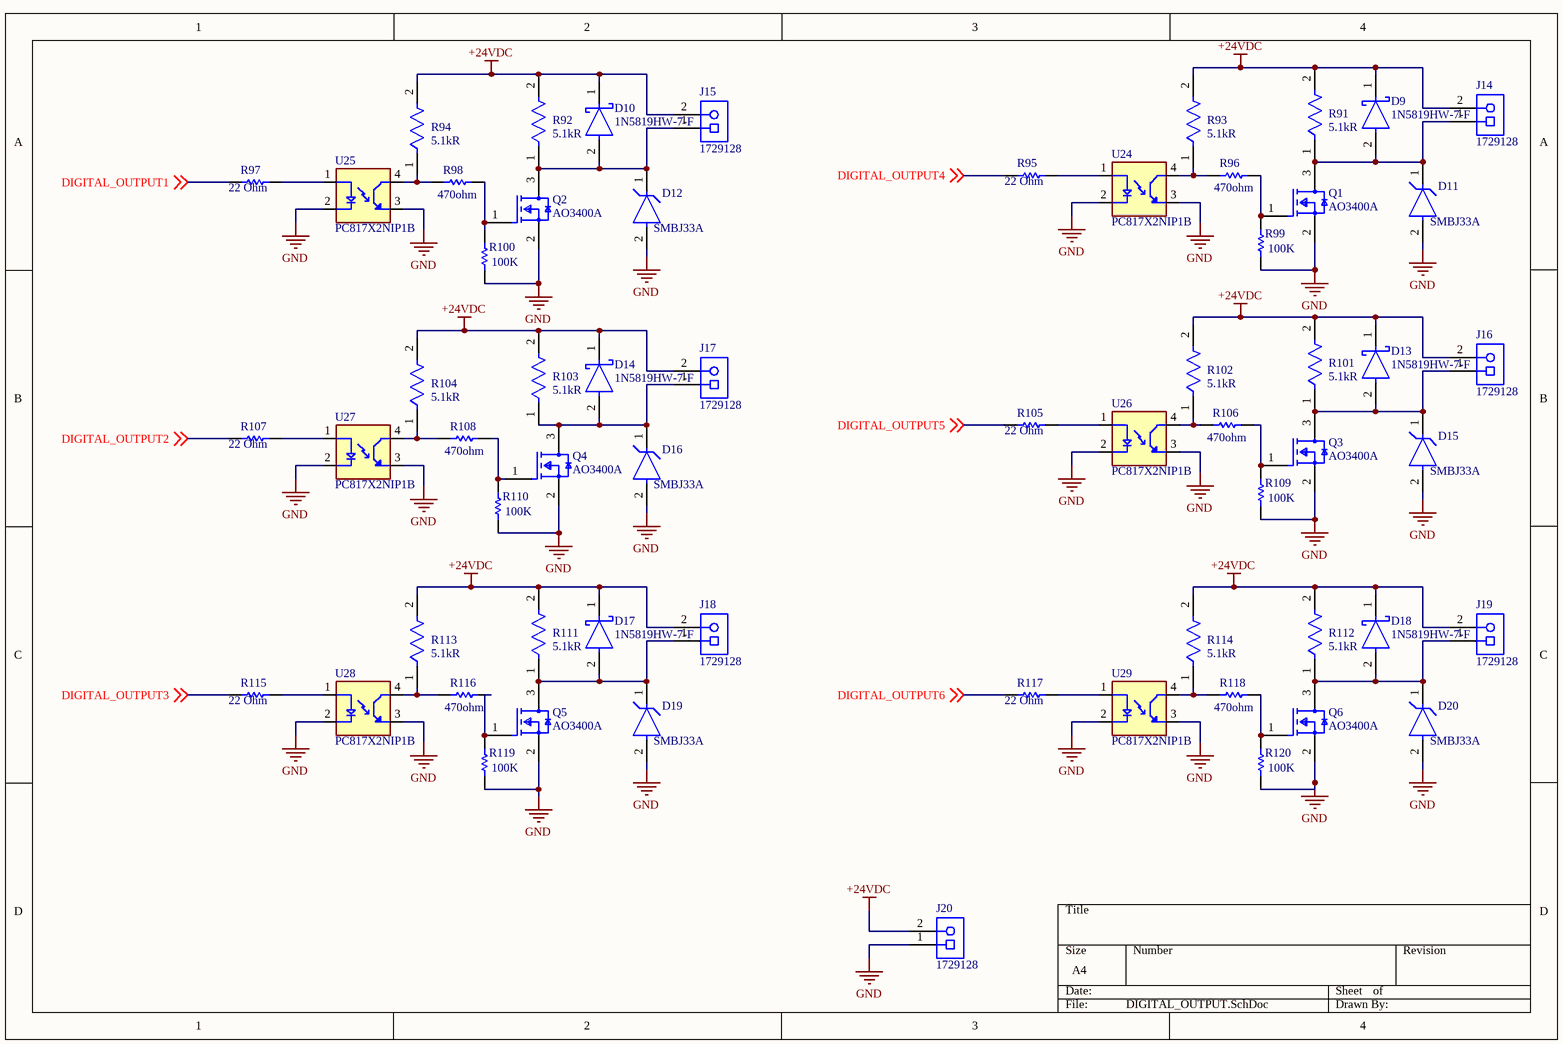
[diagram p3: DIGITAL_OUTPUT.SchDoc]

### Parts
D9  1N5819HW-7-F  [FP-SOD123-IPC_A]
D10  1N5819HW-7-F  [FP-SOD123-IPC_A]
D11  SMBJ33A  [FP-SMBJ-MFG]
D12  SMBJ33A  [FP-SMBJ-MFG]
D13  1N5819HW-7-F  [FP-SOD123-IPC_A]
D14  1N5819HW-7-F  [FP-SOD123-IPC_A]
D15  SMBJ33A  [FP-SMBJ-MFG]
D16  SMBJ33A  [FP-SMBJ-MFG]
D17  1N5819HW-7-F  [FP-SOD123-IPC_A]
D18  1N5819HW-7-F  [FP-SOD123-IPC_A]
D19  SMBJ33A  [FP-SMBJ-MFG]
D20  SMBJ33A  [FP-SMBJ-MFG]
J14  1729128  [PHOE-1729128-2_V]
J15  1729128  [PHOE-1729128-2_V]
J16  1729128  [PHOE-1729128-2_V]
J17  1729128  [PHOE-1729128-2_V]
J18  1729128  [PHOE-1729128-2_V]
J19  1729128  [PHOE-1729128-2_V]
J20  1729128  [PHOE-1729128-2_V]
Q1  AO3400A  [FP-SOT23-MFG]
Q2  AO3400A  [FP-SOT23-MFG]
Q3  AO3400A  [FP-SOT23-MFG]
Q4  AO3400A  [FP-SOT23-MFG]
Q5  AO3400A  [FP-SOT23-MFG]
Q6  AO3400A  [FP-SOT23-MFG]
R91  Resistance: 5.1kR  [FP-CRCW0603-e3-IPC_C]  (hidden comment: CRCW06035K10FKEA)
R92  Resistance: 5.1kR  [FP-CRCW0603-e3-IPC_C]  (hidden comment: CRCW06035K10FKEA)
R93  Resistance: 5.1kR  [FP-CRCW0603-e3-IPC_C]  (hidden comment: CRCW06035K10FKEA)
R94  Resistance: 5.1kR  [FP-CRCW0603-e3-IPC_C]  (hidden comment: CRCW06035K10FKEA)
R95  Resistance: 22 Ohm  [RESC1608X55X30LL15T15]  (hidden comment: ERJ-3EKF2200V)
R96  Resistance: 470ohm  [RESC2013X60X35LL10T20]  (hidden comment: RC0805FR-07470RL)
R97  Resistance: 22 Ohm  [RESC1608X55X30LL15T15]  (hidden comment: ERJ-3EKF2200V)
R98  Resistance: 470ohm  [RESC2013X60X35LL10T20]  (hidden comment: RC0805FR-07470RL)
R99  value 100K  [RESC2013X50X30ML20T20]  (hidden comment: CRCW0805100KJNEA)
R100  value 100K  [RESC2013X50X30ML20T20]  (hidden comment: CRCW0805100KJNEA)
R101  Resistance: 5.1kR  [FP-CRCW0603-e3-IPC_C]  (hidden comment: CRCW06035K10FKEA)
R102  Resistance: 5.1kR  [FP-CRCW0603-e3-IPC_C]  (hidden comment: CRCW06035K10FKEA)
R103  Resistance: 5.1kR  [FP-CRCW0603-e3-IPC_C]  (hidden comment: CRCW06035K10FKEA)
R104  Resistance: 5.1kR  [FP-CRCW0603-e3-IPC_C]  (hidden comment: CRCW06035K10FKEA)
R105  Resistance: 22 Ohm  [RESC1608X55X30LL15T15]  (hidden comment: ERJ-3EKF2200V)
R106  Resistance: 470ohm  [RESC2013X60X35LL10T20]  (hidden comment: RC0805FR-07470RL)
R107  Resistance: 22 Ohm  [RESC1608X55X30LL15T15]  (hidden comment: ERJ-3EKF2200V)
R108  Resistance: 470ohm  [RESC2013X60X35LL10T20]  (hidden comment: RC0805FR-07470RL)
R109  value 100K  [RESC2013X50X30ML20T20]  (hidden comment: CRCW0805100KJNEA)
R110  value 100K  [RESC2013X50X30ML20T20]  (hidden comment: CRCW0805100KJNEA)
R111  Resistance: 5.1kR  [FP-CRCW0603-e3-IPC_C]  (hidden comment: CRCW06035K10FKEA)
R112  Resistance: 5.1kR  [FP-CRCW0603-e3-IPC_C]  (hidden comment: CRCW06035K10FKEA)
R113  Resistance: 5.1kR  [FP-CRCW0603-e3-IPC_C]  (hidden comment: CRCW06035K10FKEA)
R114  Resistance: 5.1kR  [FP-CRCW0603-e3-IPC_C]  (hidden comment: CRCW06035K10FKEA)
R115  Resistance: 22 Ohm  [RESC1608X55X30LL15T15]  (hidden comment: ERJ-3EKF2200V)
R116  Resistance: 470ohm  [RESC2013X60X35LL10T20]  (hidden comment: RC0805FR-07470RL)
R117  Resistance: 22 Ohm  [RESC1608X55X30LL15T15]  (hidden comment: ERJ-3EKF2200V)
R118  Resistance: 470ohm  [RESC2013X60X35LL10T20]  (hidden comment: RC0805FR-07470RL)
R119  value 100K  [RESC2013X50X30ML20T20]  (hidden comment: CRCW0805100KJNEA)
R120  value 100K  [RESC2013X50X30ML20T20]  (hidden comment: CRCW0805100KJNEA)
U24  PC817X2NIP1B  [SOIC254P960X420-4N]
U25  PC817X2NIP1B  [SOIC254P960X420-4N]
U26  PC817X2NIP1B  [SOIC254P960X420-4N]
U27  PC817X2NIP1B  [SOIC254P960X420-4N]
U28  PC817X2NIP1B  [SOIC254P960X420-4N]
U29  PC817X2NIP1B  [SOIC254P960X420-4N]

### Nets
+24VDC: D9.1(C) D10.1(C) D13.1(C) D14.1(C) D17.1(C) D18.1(C) J14.2 J15.2 J16.2 J17.2 J18.2 J19.2 J20.2 R91.2 R92.2 R93.2 R94.2 R101.2 R102.2 R103.2 R104.2 R111.2 R112.2 R113.2 R114.2
GND: D11.2(A) D12.2(A) D15.2(A) D16.2(A) D19.2(A) D20.2(A) J20.1 Q1.2(S) Q2.2(S) Q3.2(S) Q4.2(S) Q5.2(S) Q6.2(S) R99.1 R100.1 R109.1 R110.1 R119.1 R120.1 U24.2(C) U24.3(ET) U25.2(C) U25.3(ET) U26.2(C) U26.3(ET) U27.2(C) U27.3(ET) U28.2(C) U28.3(ET) U29.2(C) U29.3(ET)
DIGITAL_OUTPUT1: R97.1 ; off-sheet DIGITAL_OUTPUT1
DIGITAL_OUTPUT2: R107.1 ; off-sheet DIGITAL_OUTPUT2
DIGITAL_OUTPUT3: R115.1 ; off-sheet DIGITAL_OUTPUT3
DIGITAL_OUTPUT4: R95.1 ; off-sheet DIGITAL_OUTPUT4
DIGITAL_OUTPUT5: R105.1 ; off-sheet DIGITAL_OUTPUT5
DIGITAL_OUTPUT6: R117.1 ; off-sheet DIGITAL_OUTPUT6
NetD9_2: D9.2(A) D11.1(C) J14.1 Q1.3(D) R91.1
NetD10_2: D10.2(A) D12.1(C) J15.1 Q2.3(D) R92.1
NetD13_2: D13.2(A) D15.1(C) J16.1 Q3.3(D) R101.1
NetD14_2: D14.2(A) D16.1(C) J17.1 Q4.3(D) R103.1
NetD17_2: D17.2(A) D19.1(C) J18.1 Q5.3(D) R111.1
NetD18_2: D18.2(A) D20.1(C) J19.1 Q6.3(D) R112.1
NetQ1_1: Q1.1(G) R96.2 R99.2
NetQ2_1: Q2.1(G) R98.2 R100.2
NetQ3_1: Q3.1(G) R106.2 R109.2
NetQ4_1: Q4.1(G) R108.2 R110.2
NetQ5_1: Q5.1(G) R116.2 R119.2
NetQ6_1: Q6.1(G) R118.2 R120.2
NetR93_1: R93.1 R96.1 U24.4(CT)
NetR94_1: R94.1 R98.1 U25.4(CT)
NetR95_2: R95.2 U24.1(A)
NetR97_2: R97.2 U25.1(A)
NetR102_1: R102.1 R106.1 U26.4(CT)
NetR104_1: R104.1 R108.1 U27.4(CT)
NetR105_2: R105.2 U26.1(A)
NetR107_2: R107.2 U27.1(A)
NetR113_1: R113.1 R116.1 U28.4(CT)
NetR114_1: R114.1 R118.1 U29.4(CT)
NetR115_2: R115.2 U28.1(A)
NetR117_2: R117.2 U29.1(A)

### Library data of the parts
D9 D10 D13 D14 D17 D18 = CMP-0303-00003-3: DIODE SCHOTTKY 40V 1A SOD123; Forward Voltage: 450mV; Capacitance: 110pF; Max Forward Surge Current (Ifsm): 25A; Peak Reverse Current: 50uA; Polarity: Standard; Element Configuration: Single; Max Power Dissipation: 450mW; Min Operating Temperature: -65°C; Package Quantity: 3000; Contact Plating: Tin; Weight: 0.000353oz; Max Repetitive Reverse Voltage (Vrrm): 40V; Max Reverse Voltage (DC): 40V; Height: 1.25mm; Average Rectified Current: 1A; Width: 1.7mm; Case/Package: SOD-123-2; Lead Free: Lead Free; Max Operating Temperature: 125°C; Current Rating: 1A; Termination: SMD/SMT; Forward Current: 1A; Radiation Hardening: No; Number of Pins: 2; Length: 2.85mm; Voltage Rating (DC): 40V; REACH SVHC: No SVHC; Peak Non-Repetitive Surge Current: 25A; Packaging: Tape and Reel; Output Current: 1A
D11 D12 D15 D16 D19 D20 = CMP-2000-07095-2: TVS DIODE 33V 53.3V DO214AA; Manufacturer: Littelfuse Inc; Max Junction Temp: +150°C; Number Of Channels: 1; Breakdown Voltage: 36.7V; Peak Pulse Power: 600W; Direction: Unidirectional; Peak Pulse Current: 11.3A; Lead Free: Yes; Height: 2.61mm; Temperature Range Low: -65°C; ComponentLink2URL: https://www.littelfuse.com/~/media/electronics/datasheets/tvs_diodes/littelfuse_tvs_diode_smbj_datasheet.pdf.pdf; Manufacturer Part Number: SMBJ33A; Clamping Voltage: 53.3V; Device Class L1: Circuit Protection; Octopart: https://octopart.com/smbj33a-littelfuse-350829; Device Class L2: TVS Diodes; Digikey Description: TVS DIODE 33V 53.3V DO214AA; Automotive: No; Temperature Range High: +150°C; Package: SMBJ; ComponentLink2Description: Datasheet; Mouser Description: TVS DIODE 33V 53.3V DO214AA; Reverse Standoff Voltage: 33V; Category: Diode; Device Class L3: unset; Temperature: -65°C to +150°C; RoHS: TRUE
J14-J20 = CMP-2000-05815-1: as J2 on sheet Digital_Input; Manufacturer URL: http://www.phoenixcontact.com/; Datasheet URL: https://datasheet.ciiva.com/16046/1729128-16046181.pdf; RoHS: TRUE; Package URL: https://www.phoenixcontact.com/online/portal/pi/pxc/product_detail_page/!ut/p/b1/3VdJjqNKFDxLH8AFycySyWY2ozFsEPOMMQaDOX1XedGL_1Vdm5YXJleknhSKeBkvI6EA8ncAo3AYoDhBQGco6KN7VURTdemj9us_IEKEZo_YHiPAEWEFmDGOHMORkqKYCORBZxgL7ZoaZYcbFFUZ3fqxSY6GOuxydWUuHqz1ynmMFygu583Bob0Ewr6Sd_l-5m-kAueHiB0jpRwZwe58wwtkpxtMYd_LmGcDRU02dRNEyWt6Y2ti5pSyJ_reIkzIulrqApdnbT11V5jnCKbYNCvhEM1MCpPByat_X379-iThf08CI5GfOPqfBeS3BRoBOdD55AKVv0iLwCMq-2BrzXWSGRH7pUGD9uwXQjiph3xL0DKQwdGa0JImiIOmBNOestqgwTHSSs2oOep-78apyXQBvNi8ZLaFjvjWvcaUEBu0MC6Wbe-d6mB0FAebo2lUWinqYaZs5DAYzV0RP9yitUjnGJ0iI9xhZkT42OCQNUJJhkgWINNQLP2JFP6OpMg3JCVg70jqHT0lvKOnhHf0lPuOnnLf0VPuWx6_dxwUIvwk5WMkT0kLL1mh61l2yZVSzG3pYV_bqo-mj6uMKwKwdnnW8Jh5RTOJzMOA5c-eJDaZQw4mTMPH02PvS_ZAqNVjVTo2WyYLkwH_KU1mmmG5kjRhDqPXLwwVHvVOjCM60-fpXvTDfMGW1PVFVS1r4e4yVDk4ZdNbkUHvqPqQSeian4UD39fNKmachqdJ1NJbyk8rXT9mXTvPk3oE5meulKGgiruPJek-4I9hTT6G8ZLOyRSm2RRVbThERQad5OS28hdt4YW4vG0stgYYzsWsK4_7y6DZMjJSCqri1kyiZR5vD7pwIrNR7QwPHTcLTI5qT7eRlpHrdGiupYlqQDJ7zy_CND8fWWBoLRXxk1RVcXiBQwbTD4Xi7KL-FuO94t9xaqweXzH; PartNumber: 1729128; Package Description: 2-Pin Through Hole Device, Body 8.1 x 10.16 mm, Pitch 5.08 mm; Datasheet Version: 12/2013; Mounting Technology: ThroughHole; Orientation: Horizontal; Package Reference: 1729128-2; Packing: Bulk
Q1-Q6 = CMP-83955-000006-1: MOSFET N-CH 30V 5.7A SOT23; Input Capacitance: 630pF; Number of Elements: 1; Rds On Max: 26.5mR; Max Power Dissipation: 1.4W; Gate to Source Voltage (Vgs): 12V; Min Operating Temperature: -55°C; Lead Free: Lead Free; Number of Pins: 3; Drain to Source Voltage (Vdss): 30V; Case/Package: SOT-23; Mount: Surface Mount; Continuous Drain Current (ID): 5.7A; Radiation Hardening: No; Packaging: Tape and Reel; Max Operating Temperature: 150°C; Power Dissipation: 1.4W
R91-R94 R101-R104 R111-R114 = CMP-1012-00590-3: RES Thick Film, 5.1kΩ, 1%, 0.1W, 100ppm/°C, 0603; Power Rating: 100mW; Voltage Rating (DC): 75V; Width: 0.85mm; Depth: 0.85mm; Military Standard: Not; Package Quantity: 5000; Case Code (Metric): 1608; Length: 1.55mm; Weight: 7.1E-05oz; Packaging: Tape and Reel; Temperature Coefficient: 100ppm/°C; Case Code (Imperial): 0603; Lead Free: Lead Free; Radiation Hardening: No; Contact Plating: Tin; Composition: Thick Film; Max Operating Temperature: 155°C; Termination: SMD/SMT; Case/Package: 0603; Min Operating Temperature: -55°C; Tolerance: 1%; Voltage Rating: 75V; Mount: Surface Mount; Height: 0.45mm
R95 R97 R105 R107 R115 R117 = CMP-2000-00335-2: Chip Resistor, 220 Ohm, +/- 1%, 0.1 W, -55 to 155 degC, 0603 (1608 Metric), RoHS, Tape and Reel; Voltage Rating: 50 V; Power Rating: 100 mW; Case\Package: 0603; ComponentLink2Description: Datasheet; PackageDescription: 2-Pin Surface Mount Device, Body 1.6 x 0.85 mm; PackageReference: 0603; ComponentLink1Description: Manufacturer URL; ComponentLink2URL: http://industrial.panasonic.com/cdbs/www-data/pdf/RDA0000/AOA0000C86.pdf; Height: 0.45 mm; Mount: Surface Mount; Case Code (Metric): 1608; Pins: 2; Width: 0.8 mm; Length: 1.6 mm; Package Quantity: 5000; Tolerance: 1%; ComponentLink1URL: http://www.panasonic.com/; Max Operating Temperature: 155 degC; Min Operating Temperature: -55 degC; RoHSCompliant: true; Packaging: Tape and Reel; Case Code (Imperial): 0603; DatasheetVersion: Apr-15; REACH SVHC: No SVHC; Voltage Rating (DC): 50 V
R96 R98 R106 R108 R116 R118 = CMP-2000-06961-1: Chip Resistor, 470 Ohm, +/- 1%, 125 mW, -55 to 155 degC, 0805 (2012 Metric), RoHS, Tape and Reel; Manufacturer: Yageo; Power Rating: 250mW; Resistor Case Style: 0805[2012Metric]; Voltage Rating: 150V; Resistor Element Type: ThickFilm; Temperature Coefficient: ±100ppm/°C; SVHC: ToBeAdvised; Datasheet Version: Rev. 7, 05/2017; Automotive Qualification Standard: -; Mounting Technology: SurfaceMount; Product Range: -; Packaging: Tape&Reel; Package Description: 2-Pin Surface Mounted Device, Body 2 x 1.25 mm; MSL: MSL1-Unlimited; Package Reference: 0805; Resistance Tolerance: ±1%; Datasheet URL: http://www.yageo.com/documents/recent/PYu-RC_Group_51_RoHS_L_7.pdf; Manufacturer URL: http://www.yageo.com/
R99 R100 R109 R110 R119 R120 = CMP-2001-04900-1: Manufacturer: Vishay Dale; Part Number: CRCW0805100KJNEA
U24-U29 = PC817X2NIP1B: Optocoupler DC-IN 1-CH Transistor DC-OUT 4-Pin DIP SMD T/R; MF: Sharp Microelectronics; SnapEDA_Link: https://www.snapeda.com/parts/PC817X2NIP1B/Sharp+Microelectronics/view-part/?ref=snap; Package: SMD-4 Sharp Microelectronics; Value: *; MP: PC817X2NIP1B; Check_prices: https://www.snapeda.com/parts/PC817X2NIP1B/Sharp+Microelectronics/view-part/?ref=eda

## Sheet DIGITAL_OUTPUT1.SchDoc
size A4; SheetNumber: 6; SheetTotal: 16
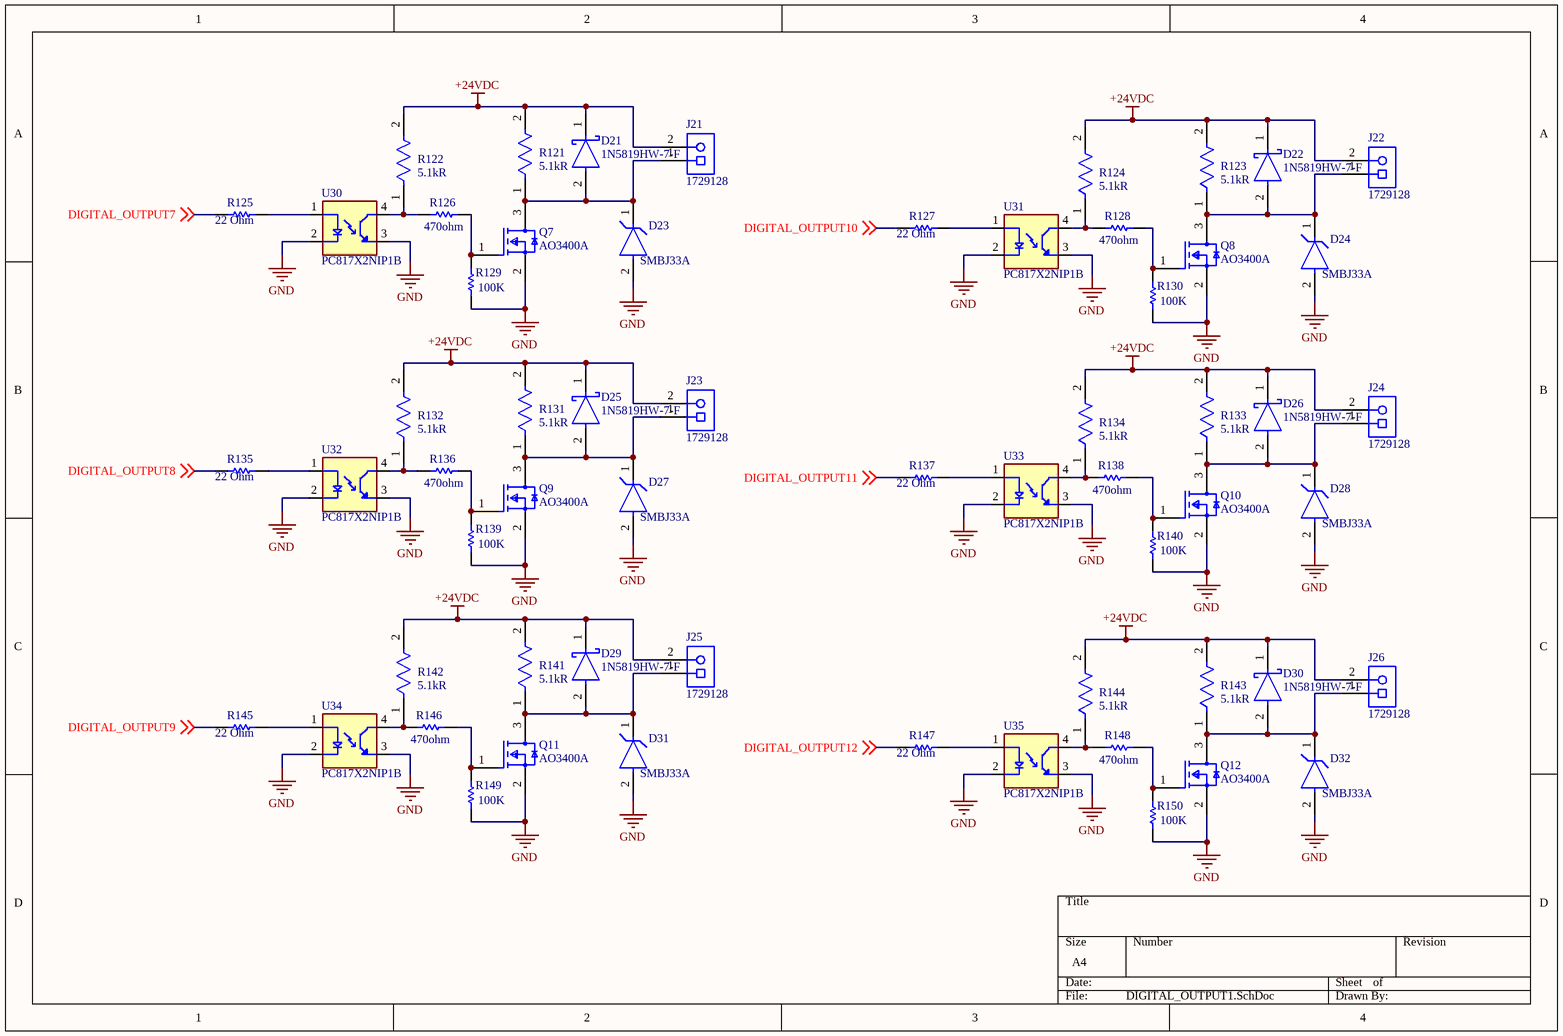
[diagram p4: DIGITAL_OUTPUT1.SchDoc]

### Parts
D21  1N5819HW-7-F  [FP-SOD123-IPC_A]
D22  1N5819HW-7-F  [FP-SOD123-IPC_A]
D23  SMBJ33A  [FP-SMBJ-MFG]
D24  SMBJ33A  [FP-SMBJ-MFG]
D25  1N5819HW-7-F  [FP-SOD123-IPC_A]
D26  1N5819HW-7-F  [FP-SOD123-IPC_A]
D27  SMBJ33A  [FP-SMBJ-MFG]
D28  SMBJ33A  [FP-SMBJ-MFG]
D29  1N5819HW-7-F  [FP-SOD123-IPC_A]
D30  1N5819HW-7-F  [FP-SOD123-IPC_A]
D31  SMBJ33A  [FP-SMBJ-MFG]
D32  SMBJ33A  [FP-SMBJ-MFG]
J21  1729128  [PHOE-1729128-2_V]
J22  1729128  [PHOE-1729128-2_V]
J23  1729128  [PHOE-1729128-2_V]
J24  1729128  [PHOE-1729128-2_V]
J25  1729128  [PHOE-1729128-2_V]
J26  1729128  [PHOE-1729128-2_V]
Q7  AO3400A  [FP-SOT23-MFG]
Q8  AO3400A  [FP-SOT23-MFG]
Q9  AO3400A  [FP-SOT23-MFG]
Q10  AO3400A  [FP-SOT23-MFG]
Q11  AO3400A  [FP-SOT23-MFG]
Q12  AO3400A  [FP-SOT23-MFG]
R121  Resistance: 5.1kR  [FP-CRCW0603-e3-IPC_C]  (hidden comment: CRCW06035K10FKEA)
R122  Resistance: 5.1kR  [FP-CRCW0603-e3-IPC_C]  (hidden comment: CRCW06035K10FKEA)
R123  Resistance: 5.1kR  [FP-CRCW0603-e3-IPC_C]  (hidden comment: CRCW06035K10FKEA)
R124  Resistance: 5.1kR  [FP-CRCW0603-e3-IPC_C]  (hidden comment: CRCW06035K10FKEA)
R125  Resistance: 22 Ohm  [RESC1608X55X30LL15T15]  (hidden comment: ERJ-3EKF2200V)
R126  Resistance: 470ohm  [RESC2013X60X35LL10T20]  (hidden comment: RC0805FR-07470RL)
R127  Resistance: 22 Ohm  [RESC1608X55X30LL15T15]  (hidden comment: ERJ-3EKF2200V)
R128  Resistance: 470ohm  [RESC2013X60X35LL10T20]  (hidden comment: RC0805FR-07470RL)
R129  value 100K  [RESC2013X50X30ML20T20]  (hidden comment: CRCW0805100KJNEA)
R130  value 100K  [RESC2013X50X30ML20T20]  (hidden comment: CRCW0805100KJNEA)
R131  Resistance: 5.1kR  [FP-CRCW0603-e3-IPC_C]  (hidden comment: CRCW06035K10FKEA)
R132  Resistance: 5.1kR  [FP-CRCW0603-e3-IPC_C]  (hidden comment: CRCW06035K10FKEA)
R133  Resistance: 5.1kR  [FP-CRCW0603-e3-IPC_C]  (hidden comment: CRCW06035K10FKEA)
R134  Resistance: 5.1kR  [FP-CRCW0603-e3-IPC_C]  (hidden comment: CRCW06035K10FKEA)
R135  Resistance: 22 Ohm  [RESC1608X55X30LL15T15]  (hidden comment: ERJ-3EKF2200V)
R136  Resistance: 470ohm  [RESC2013X60X35LL10T20]  (hidden comment: RC0805FR-07470RL)
R137  Resistance: 22 Ohm  [RESC1608X55X30LL15T15]  (hidden comment: ERJ-3EKF2200V)
R138  Resistance: 470ohm  [RESC2013X60X35LL10T20]  (hidden comment: RC0805FR-07470RL)
R139  value 100K  [RESC2013X50X30ML20T20]  (hidden comment: CRCW0805100KJNEA)
R140  value 100K  [RESC2013X50X30ML20T20]  (hidden comment: CRCW0805100KJNEA)
R141  Resistance: 5.1kR  [FP-CRCW0603-e3-IPC_C]  (hidden comment: CRCW06035K10FKEA)
R142  Resistance: 5.1kR  [FP-CRCW0603-e3-IPC_C]  (hidden comment: CRCW06035K10FKEA)
R143  Resistance: 5.1kR  [FP-CRCW0603-e3-IPC_C]  (hidden comment: CRCW06035K10FKEA)
R144  Resistance: 5.1kR  [FP-CRCW0603-e3-IPC_C]  (hidden comment: CRCW06035K10FKEA)
R145  Resistance: 22 Ohm  [RESC1608X55X30LL15T15]  (hidden comment: ERJ-3EKF2200V)
R146  Resistance: 470ohm  [RESC2013X60X35LL10T20]  (hidden comment: RC0805FR-07470RL)
R147  Resistance: 22 Ohm  [RESC1608X55X30LL15T15]  (hidden comment: ERJ-3EKF2200V)
R148  Resistance: 470ohm  [RESC2013X60X35LL10T20]  (hidden comment: RC0805FR-07470RL)
R149  value 100K  [RESC2013X50X30ML20T20]  (hidden comment: CRCW0805100KJNEA)
R150  value 100K  [RESC2013X50X30ML20T20]  (hidden comment: CRCW0805100KJNEA)
U30  PC817X2NIP1B  [SOIC254P960X420-4N]
U31  PC817X2NIP1B  [SOIC254P960X420-4N]
U32  PC817X2NIP1B  [SOIC254P960X420-4N]
U33  PC817X2NIP1B  [SOIC254P960X420-4N]
U34  PC817X2NIP1B  [SOIC254P960X420-4N]
U35  PC817X2NIP1B  [SOIC254P960X420-4N]

### Nets
+24VDC: D21.1(C) D22.1(C) D25.1(C) D26.1(C) D29.1(C) D30.1(C) J21.2 J22.2 J23.2 J24.2 J25.2 J26.2 R121.2 R122.2 R123.2 R124.2 R131.2 R132.2 R133.2 R134.2 R141.2 R142.2 R143.2 R144.2
GND: D23.2(A) D24.2(A) D27.2(A) D28.2(A) D31.2(A) D32.2(A) Q7.2(S) Q8.2(S) Q9.2(S) Q10.2(S) Q11.2(S) Q12.2(S) R129.1 R130.1 R139.1 R140.1 R149.1 R150.1 U30.2(C) U30.3(ET) U31.2(C) U31.3(ET) U32.2(C) U32.3(ET) U33.2(C) U33.3(ET) U34.2(C) U34.3(ET) U35.2(C) U35.3(ET)
DIGITAL_OUTPUT7: R125.1 ; off-sheet DIGITAL_OUTPUT7
DIGITAL_OUTPUT8: R135.1 ; off-sheet DIGITAL_OUTPUT8
DIGITAL_OUTPUT9: R145.1 ; off-sheet DIGITAL_OUTPUT9
DIGITAL_OUTPUT10: R127.1 ; off-sheet DIGITAL_OUTPUT10
DIGITAL_OUTPUT11: R137.1 ; off-sheet DIGITAL_OUTPUT11
DIGITAL_OUTPUT12: R147.1 ; off-sheet DIGITAL_OUTPUT12
NetD21_2: D21.2(A) D23.1(C) J21.1 Q7.3(D) R121.1
NetD22_2: D22.2(A) D24.1(C) J22.1 Q8.3(D) R123.1
NetD25_2: D25.2(A) D27.1(C) J23.1 Q9.3(D) R131.1
NetD26_2: D26.2(A) D28.1(C) J24.1 Q10.3(D) R133.1
NetD29_2: D29.2(A) D31.1(C) J25.1 Q11.3(D) R141.1
NetD30_2: D30.2(A) D32.1(C) J26.1 Q12.3(D) R143.1
NetQ7_1: Q7.1(G) R126.2 R129.2
NetQ8_1: Q8.1(G) R128.2 R130.2
NetQ9_1: Q9.1(G) R136.2 R139.2
NetQ10_1: Q10.1(G) R138.2 R140.2
NetQ11_1: Q11.1(G) R146.2 R149.2
NetQ12_1: Q12.1(G) R148.2 R150.2
NetR122_1: R122.1 R126.1 U30.4(CT)
NetR124_1: R124.1 R128.1 U31.4(CT)
NetR125_2: R125.2 U30.1(A)
NetR127_2: R127.2 U31.1(A)
NetR132_1: R132.1 R136.1 U32.4(CT)
NetR134_1: R134.1 R138.1 U33.4(CT)
NetR135_2: R135.2 U32.1(A)
NetR137_2: R137.2 U33.1(A)
NetR142_1: R142.1 R146.1 U34.4(CT)
NetR144_1: R144.1 R148.1 U35.4(CT)
NetR145_2: R145.2 U34.1(A)
NetR147_2: R147.2 U35.1(A)

### Library data of the parts
D21 D22 D25 D26 D29 D30 = CMP-0303-00003-3: as D9 on sheet DIGITAL_OUTPUT; Min Operating Temperature: -65°C; Package Quantity: 3000; Contact Plating: Tin; Weight: 0.000353oz; Max Repetitive Reverse Voltage (Vrrm): 40V; Max Reverse Voltage (DC): 40V; Height: 1.25mm; Average Rectified Current: 1A; Width: 1.7mm; Case/Package: SOD-123-2; Lead Free: Lead Free; Max Operating Temperature: 125°C; Current Rating: 1A; Termination: SMD/SMT; Forward Current: 1A; Radiation Hardening: No; Number of Pins: 2; Length: 2.85mm; Voltage Rating (DC): 40V; REACH SVHC: No SVHC; Peak Non-Repetitive Surge Current: 25A; Packaging: Tape and Reel; Output Current: 1A
D23 D24 D27 D28 D31 D32 = CMP-2000-07095-2: as D11 on sheet DIGITAL_OUTPUT; Lead Free: Yes; Height: 2.61mm; Temperature Range Low: -65°C; ComponentLink2URL: https://www.littelfuse.com/~/media/electronics/datasheets/tvs_diodes/littelfuse_tvs_diode_smbj_datasheet.pdf.pdf; Manufacturer Part Number: SMBJ33A; Clamping Voltage: 53.3V; Device Class L1: Circuit Protection; Octopart: https://octopart.com/smbj33a-littelfuse-350829; Device Class L2: TVS Diodes; Digikey Description: TVS DIODE 33V 53.3V DO214AA; Automotive: No; Temperature Range High: +150°C; Package: SMBJ; ComponentLink2Description: Datasheet; Mouser Description: TVS DIODE 33V 53.3V DO214AA; Reverse Standoff Voltage: 33V; Category: Diode; Device Class L3: unset; Temperature: -65°C to +150°C; RoHS: TRUE
J21-J26 = CMP-2000-05815-1: as J2 on sheet Digital_Input; Manufacturer URL: http://www.phoenixcontact.com/; Datasheet URL: https://datasheet.ciiva.com/16046/1729128-16046181.pdf; RoHS: TRUE; Package URL: https://www.phoenixcontact.com/online/portal/pi/pxc/product_detail_page/!ut/p/b1/3VdJjqNKFDxLH8AFycySyWY2ozFsEPOMMQaDOX1XedGL_1Vdm5YXJleknhSKeBkvI6EA8ncAo3AYoDhBQGco6KN7VURTdemj9us_IEKEZo_YHiPAEWEFmDGOHMORkqKYCORBZxgL7ZoaZYcbFFUZ3fqxSY6GOuxydWUuHqz1ynmMFygu583Bob0Ewr6Sd_l-5m-kAueHiB0jpRwZwe58wwtkpxtMYd_LmGcDRU02dRNEyWt6Y2ti5pSyJ_reIkzIulrqApdnbT11V5jnCKbYNCvhEM1MCpPByat_X379-iThf08CI5GfOPqfBeS3BRoBOdD55AKVv0iLwCMq-2BrzXWSGRH7pUGD9uwXQjiph3xL0DKQwdGa0JImiIOmBNOestqgwTHSSs2oOep-78apyXQBvNi8ZLaFjvjWvcaUEBu0MC6Wbe-d6mB0FAebo2lUWinqYaZs5DAYzV0RP9yitUjnGJ0iI9xhZkT42OCQNUJJhkgWINNQLP2JFP6OpMg3JCVg70jqHT0lvKOnhHf0lPuOnnLf0VPuWx6_dxwUIvwk5WMkT0kLL1mh61l2yZVSzG3pYV_bqo-mj6uMKwKwdnnW8Jh5RTOJzMOA5c-eJDaZQw4mTMPH02PvS_ZAqNVjVTo2WyYLkwH_KU1mmmG5kjRhDqPXLwwVHvVOjCM60-fpXvTDfMGW1PVFVS1r4e4yVDk4ZdNbkUHvqPqQSeian4UD39fNKmachqdJ1NJbyk8rXT9mXTvPk3oE5meulKGgiruPJek-4I9hTT6G8ZLOyRSm2RRVbThERQad5OS28hdt4YW4vG0stgYYzsWsK4_7y6DZMjJSCqri1kyiZR5vD7pwIrNR7QwPHTcLTI5qT7eRlpHrdGiupYlqQDJ7zy_CND8fWWBoLRXxk1RVcXiBQwbTD4Xi7KL-FuO94t9xaqweXzH; PartNumber: 1729128; Package Description: 2-Pin Through Hole Device, Body 8.1 x 10.16 mm, Pitch 5.08 mm; Datasheet Version: 12/2013; Mounting Technology: ThroughHole; Orientation: Horizontal; Package Reference: 1729128-2; Packing: Bulk
Q7-Q12 = CMP-83955-000006-1: as Q1 on sheet DIGITAL_OUTPUT; Min Operating Temperature: -55°C; Lead Free: Lead Free; Number of Pins: 3; Drain to Source Voltage (Vdss): 30V; Case/Package: SOT-23; Mount: Surface Mount; Continuous Drain Current (ID): 5.7A; Radiation Hardening: No; Packaging: Tape and Reel; Max Operating Temperature: 150°C; Power Dissipation: 1.4W
R121-R124 R131-R134 R141-R144 = CMP-1012-00590-3: as R91 on sheet DIGITAL_OUTPUT; Width: 0.85mm; Depth: 0.85mm; Military Standard: Not; Package Quantity: 5000; Case Code (Metric): 1608; Length: 1.55mm; Weight: 7.1E-05oz; Packaging: Tape and Reel; Temperature Coefficient: 100ppm/°C; Case Code (Imperial): 0603; Lead Free: Lead Free; Radiation Hardening: No; Contact Plating: Tin; Composition: Thick Film; Max Operating Temperature: 155°C; Termination: SMD/SMT; Case/Package: 0603; Min Operating Temperature: -55°C; Tolerance: 1%; Voltage Rating: 75V; Mount: Surface Mount; Height: 0.45mm
R125 R127 R135 R137 R145 R147 = CMP-2000-00335-2: as R95 on sheet DIGITAL_OUTPUT; ComponentLink2Description: Datasheet; PackageDescription: 2-Pin Surface Mount Device, Body 1.6 x 0.85 mm; PackageReference: 0603; ComponentLink1Description: Manufacturer URL; ComponentLink2URL: http://industrial.panasonic.com/cdbs/www-data/pdf/RDA0000/AOA0000C86.pdf; Height: 0.45 mm; Mount: Surface Mount; Case Code (Metric): 1608; Pins: 2; Width: 0.8 mm; Length: 1.6 mm; Package Quantity: 5000; Tolerance: 1%; ComponentLink1URL: http://www.panasonic.com/; Max Operating Temperature: 155 degC; Min Operating Temperature: -55 degC; RoHSCompliant: true; Packaging: Tape and Reel; Case Code (Imperial): 0603; DatasheetVersion: Apr-15; REACH SVHC: No SVHC; Voltage Rating (DC): 50 V
R126 R128 R136 R138 R146 R148 = CMP-2000-06961-1: as R96 on sheet DIGITAL_OUTPUT; Datasheet Version: Rev. 7, 05/2017; Automotive Qualification Standard: -; Mounting Technology: SurfaceMount; Product Range: -; Packaging: Tape&Reel; Package Description: 2-Pin Surface Mounted Device, Body 2 x 1.25 mm; MSL: MSL1-Unlimited; Package Reference: 0805; Resistance Tolerance: ±1%; Datasheet URL: http://www.yageo.com/documents/recent/PYu-RC_Group_51_RoHS_L_7.pdf; Manufacturer URL: http://www.yageo.com/
R129 R130 R139 R140 R149 R150 = CMP-2001-04900-1: Manufacturer: Vishay Dale; Part Number: CRCW0805100KJNEA
U30-U35 = PC817X2NIP1B: as U24 on sheet DIGITAL_OUTPUT; SnapEDA_Link: https://www.snapeda.com/parts/PC817X2NIP1B/Sharp+Microelectronics/view-part/?ref=snap; Package: SMD-4 Sharp Microelectronics; Value: *; MP: PC817X2NIP1B; Check_prices: https://www.snapeda.com/parts/PC817X2NIP1B/Sharp+Microelectronics/view-part/?ref=eda